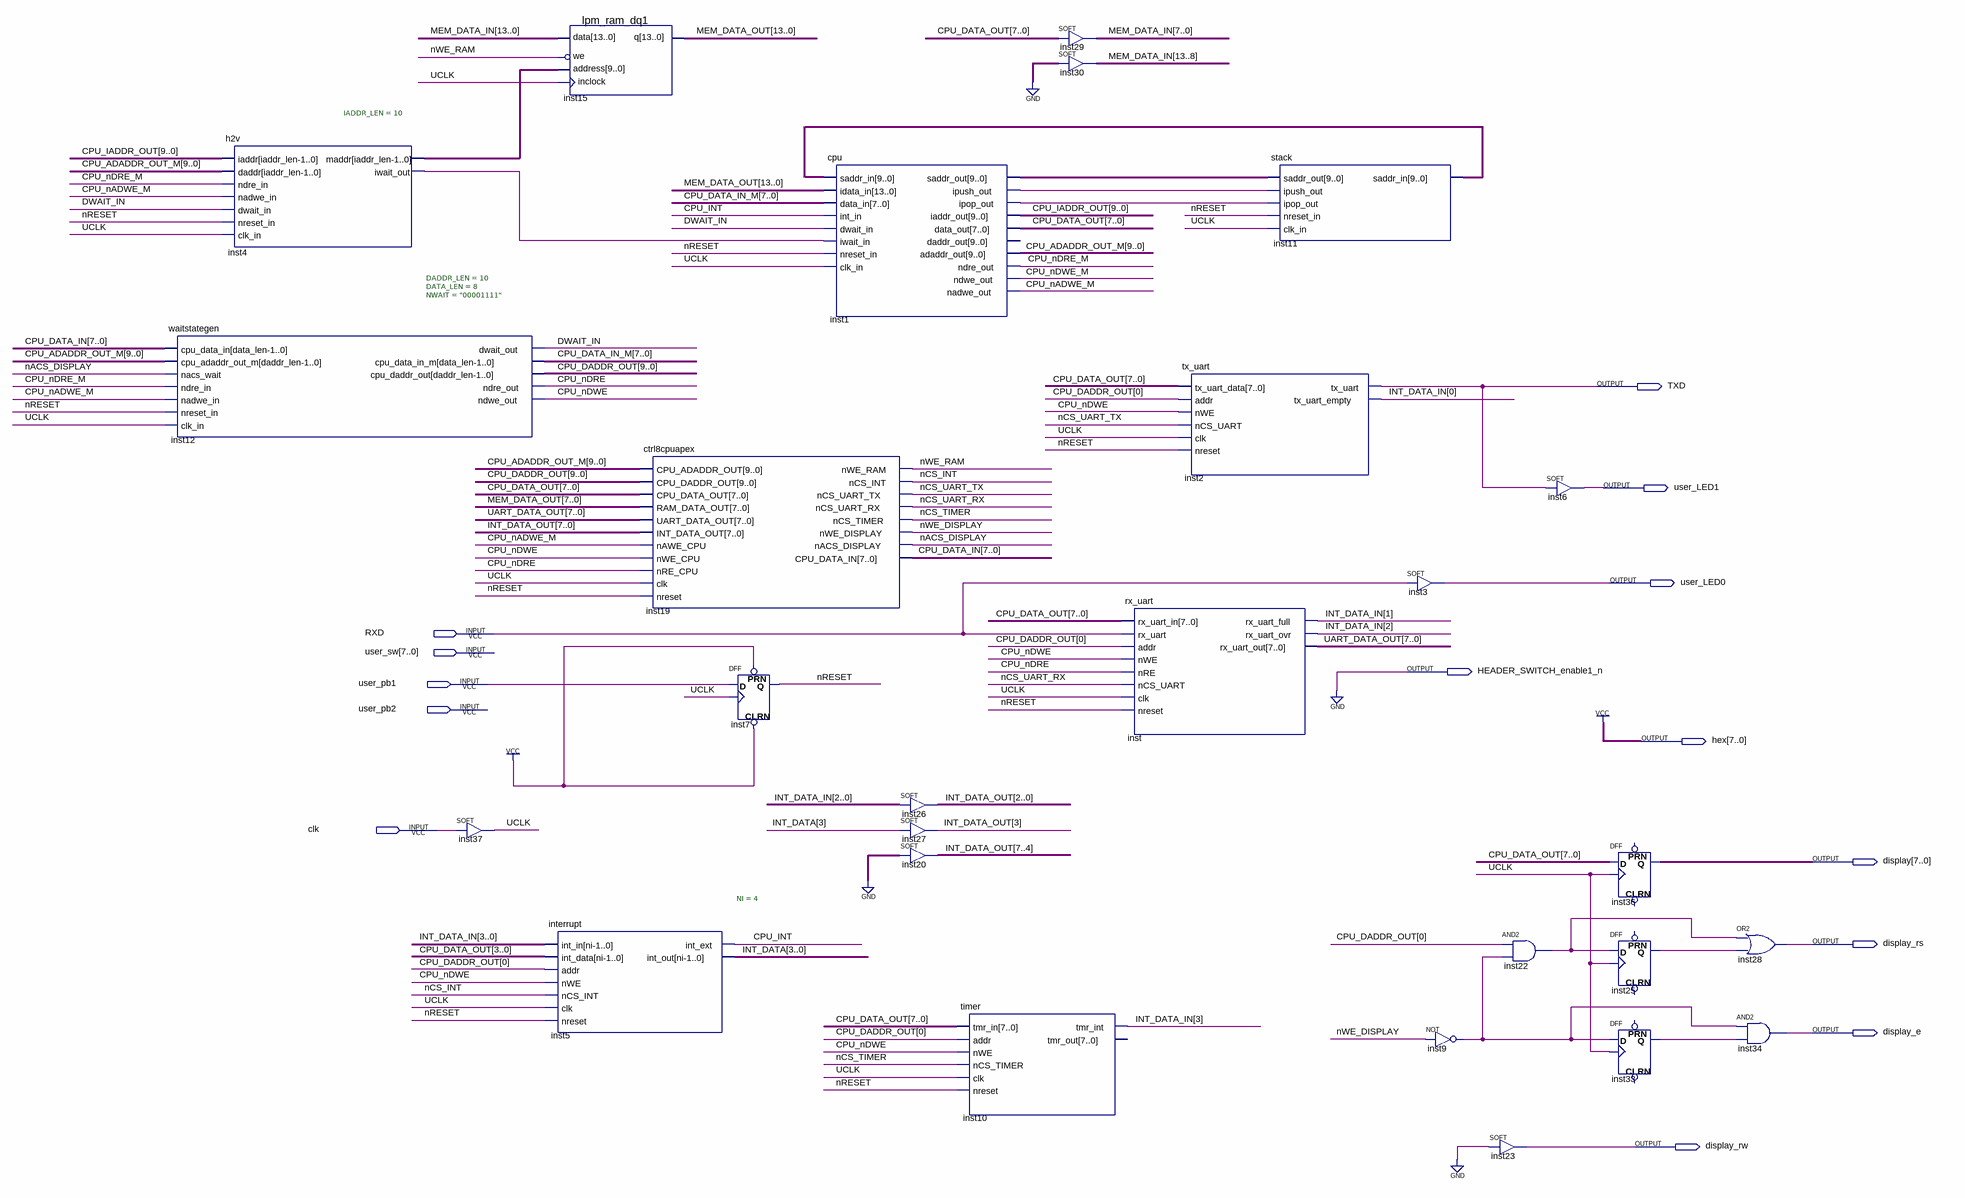
[diagram p0: schematic sheet]
// Quartus schematic cpu_a.bdf as structural Verilog: 27 symbols, 14 pins
module cpu_a (
  input  RXD,
  input  [7:0] user_sw,
  input  user_pb1,
  input  user_pb2,
  input  clk,
  output TXD,
  output user_LED1,
  output user_LED0,
  output HEADER_SWITCH_enable1_n,
  output [7:0] hex,
  output [7:0] display,
  output display_rs,
  output display_e,
  output display_rw
);

  wire CPU_INT, CPU_nADWE_M, CPU_nDRE, CPU_nDRE_M, CPU_nDWE, CPU_nDWE_M, DWAIT_IN, inst1_ipop_out,
       inst1_ipush_out, inst4_iwait_out, inst9_out, inst22_out, inst25_q, inst33_q, nACS_DISPLAY, nCS_INT,
       nCS_TIMER, nCS_UART_RX, nCS_UART_TX, nRESET, nWE_DISPLAY, nWE_RAM, UCLK;
  wire [3:0] INT_DATA, INT_DATA_IN;
  wire [7:0] CPU_DATA_IN, CPU_DATA_IN_M, CPU_DATA_OUT, INT_DATA_OUT, UART_DATA_OUT;
  wire [9:0] CPU_ADADDR_OUT_M, CPU_DADDR_OUT, CPU_IADDR_OUT, inst1_saddr_out, inst4_maddr, inst11_saddr_in;
  wire [13:0] MEM_DATA_IN, MEM_DATA_OUT;

  waitstategen #(.DADDR_LEN(10), .DATA_LEN(8), .NWAIT("00001111")) inst12 (
    .cpu_data_in(CPU_DATA_IN), .cpu_adaddr_out_m(CPU_ADADDR_OUT_M), .nacs_wait(nACS_DISPLAY),
    .ndre_in(CPU_nDRE_M), .nadwe_in(CPU_nADWE_M), .nreset_in(nRESET), .clk_in(UCLK), .dwait_out(DWAIT_IN),
    .cpu_data_in_m(CPU_DATA_IN_M), .cpu_daddr_out(CPU_DADDR_OUT), .ndre_out(CPU_nDRE), .ndwe_out(CPU_nDWE));
  h2v #(.IADDR_LEN(10)) inst4 (
    .iaddr(CPU_IADDR_OUT), .daddr(CPU_ADADDR_OUT_M), .ndre_in(CPU_nDRE_M), .nadwe_in(CPU_nADWE_M),
    .dwait_in(DWAIT_IN), .nreset_in(nRESET), .clk_in(UCLK), .maddr(inst4_maddr), .iwait_out(inst4_iwait_out));
  SOFT inst37 (.IN(clk), .OUT(UCLK));
  interrupt #(.NI(4)) inst5 (
    .int_in(INT_DATA_IN), .int_data(CPU_DATA_OUT[3:0]), .addr(CPU_DADDR_OUT[0]), .nWE(CPU_nDWE),
    .nCS_INT(nCS_INT), .clk(UCLK), .nreset(nRESET), .int_ext(CPU_INT), .int_out(INT_DATA));
  lpm_ram_dq1 inst15 (.data(MEM_DATA_IN), .we(~nWE_RAM), .address(inst4_maddr), .inclock(UCLK), .q(MEM_DATA_OUT));
  ctrl8cpuapex inst19 (
    .CPU_ADADDR_OUT(CPU_ADADDR_OUT_M), .CPU_DADDR_OUT(CPU_DADDR_OUT), .CPU_DATA_OUT(CPU_DATA_OUT),
    .RAM_DATA_OUT(MEM_DATA_OUT[7:0]), .UART_DATA_OUT(UART_DATA_OUT), .INT_DATA_OUT(INT_DATA_OUT),
    .nAWE_CPU(CPU_nADWE_M), .nWE_CPU(CPU_nDWE), .nRE_CPU(CPU_nDRE), .clk(UCLK), .nreset(nRESET),
    .nWE_RAM(nWE_RAM), .nCS_INT(nCS_INT), .nCS_UART_TX(nCS_UART_TX), .nCS_UART_RX(nCS_UART_RX),
    .nCS_TIMER(nCS_TIMER), .nWE_DISPLAY(nWE_DISPLAY), .nACS_DISPLAY(nACS_DISPLAY), .CPU_DATA_IN(CPU_DATA_IN));
  DFF inst7 (.CLRN(1'b1), .CLK(UCLK), .D(user_pb1), .PRN(1'b1), .Q(nRESET));
  cpu inst1 (
    .saddr_in(inst11_saddr_in), .idata_in(MEM_DATA_OUT), .data_in(CPU_DATA_IN_M), .int_in(CPU_INT),
    .dwait_in(DWAIT_IN), .iwait_in(inst4_iwait_out), .nreset_in(nRESET), .clk_in(UCLK),
    .saddr_out(inst1_saddr_out), .ipush_out(inst1_ipush_out), .ipop_out(inst1_ipop_out),
    .iaddr_out(CPU_IADDR_OUT), .data_out(CPU_DATA_OUT), .adaddr_out(CPU_ADADDR_OUT_M), .ndre_out(CPU_nDRE_M),
    .ndwe_out(CPU_nDWE_M), .nadwe_out(CPU_nADWE_M));  // open: daddr_out
  SOFT inst26[2:0] (.IN(INT_DATA_IN[2:0]), .OUT(INT_DATA_OUT[2:0]));
  SOFT inst27 (.IN(INT_DATA[3]), .OUT(INT_DATA_OUT[3]));
  SOFT inst20[3:0] (.IN(4'b0000), .OUT(INT_DATA_OUT[7:4]));
  timer inst10 (
    .tmr_in(CPU_DATA_OUT), .addr(CPU_DADDR_OUT[0]), .nWE(CPU_nDWE), .nCS_TIMER(nCS_TIMER), .clk(UCLK),
    .nreset(nRESET), .tmr_int(INT_DATA_IN[3]));  // open: tmr_out
  SOFT inst29[7:0] (.IN(CPU_DATA_OUT), .OUT(MEM_DATA_IN[7:0]));
  SOFT inst30[5:0] (.IN({6{1'b0}}), .OUT(MEM_DATA_IN[13:8]));
  rx_uart inst (
    .rx_uart_in(CPU_DATA_OUT), .rx_uart(RXD), .addr(CPU_DADDR_OUT[0]), .nWE(CPU_nDWE), .nRE(CPU_nDRE),
    .nCS_UART(nCS_UART_RX), .clk(UCLK), .nreset(nRESET), .rx_uart_full(INT_DATA_IN[1]),
    .rx_uart_ovr(INT_DATA_IN[2]), .rx_uart_out(UART_DATA_OUT));
  tx_uart inst2 (
    .tx_uart_data(CPU_DATA_OUT), .addr(CPU_DADDR_OUT[0]), .nWE(CPU_nDWE), .nCS_UART(nCS_UART_TX), .clk(UCLK),
    .nreset(nRESET), .tx_uart(TXD), .tx_uart_empty(INT_DATA_IN[0]));
  stack inst11 (
    .saddr_out(inst1_saddr_out), .ipush_out(inst1_ipush_out), .ipop_out(inst1_ipop_out), .nreset_in(nRESET),
    .clk_in(UCLK), .saddr_in(inst11_saddr_in));
  SOFT inst3 (.IN(RXD), .OUT(user_LED0));
  not inst9 (inst9_out, nWE_DISPLAY);
  and inst22 (inst22_out, CPU_DADDR_OUT[0], inst9_out);
  SOFT inst23 (.IN(1'b0), .OUT(display_rw));
  SOFT inst6 (.IN(TXD), .OUT(user_LED1));
  DFF inst36[7:0] (.CLK(UCLK), .D(CPU_DATA_OUT), .Q(display));  // open: CLRN, PRN
  DFF inst25 (.CLK(UCLK), .D(inst22_out), .Q(inst25_q));  // open: CLRN, PRN
  DFF inst33 (.CLK(UCLK), .D(inst9_out), .Q(inst33_q));  // open: CLRN, PRN
  or inst28 (display_rs, inst22_out, inst25_q);
  and inst34 (display_e, inst9_out, inst33_q);

  assign HEADER_SWITCH_enable1_n = 1'b0;
  assign hex = {8{1'b1}};
endmodule
